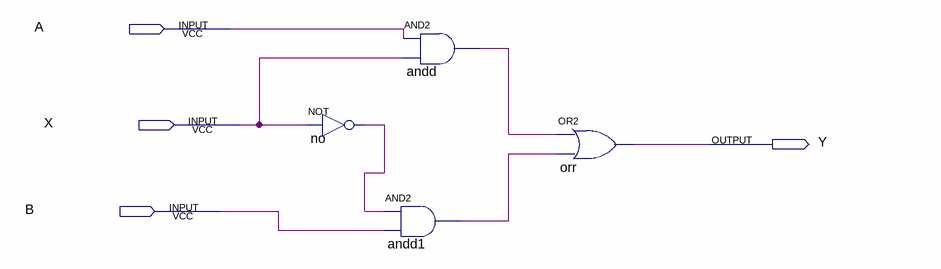
[diagram p0: schematic sheet]
// Quartus schematic MUX2POR1.bdf as structural Verilog: 4 symbols, 4 pins
module MUX2POR1 (
  input  A,
  input  X,
  input  B,
  output Y
);

  wire andd1_out, andd_out, no_out;

  not no (no_out, X);
  and andd (andd_out, A, X);
  and andd1 (andd1_out, no_out, B);
  or orr (Y, andd_out, andd1_out);
endmodule
